# EasyEDA Pro project 3轴6.1--esp32 -(0105).eprj, schematic 原理图
Board Name: esp32; Create Date: 2025-05-14; Page Name: 电源; Project Name: 3轴6.1--esp32 -(0105); Schematic Name: 原理图; Update Date: 2026-01-12; Company: 嘉立创EDA; Page Size: A3; Version: V1.0
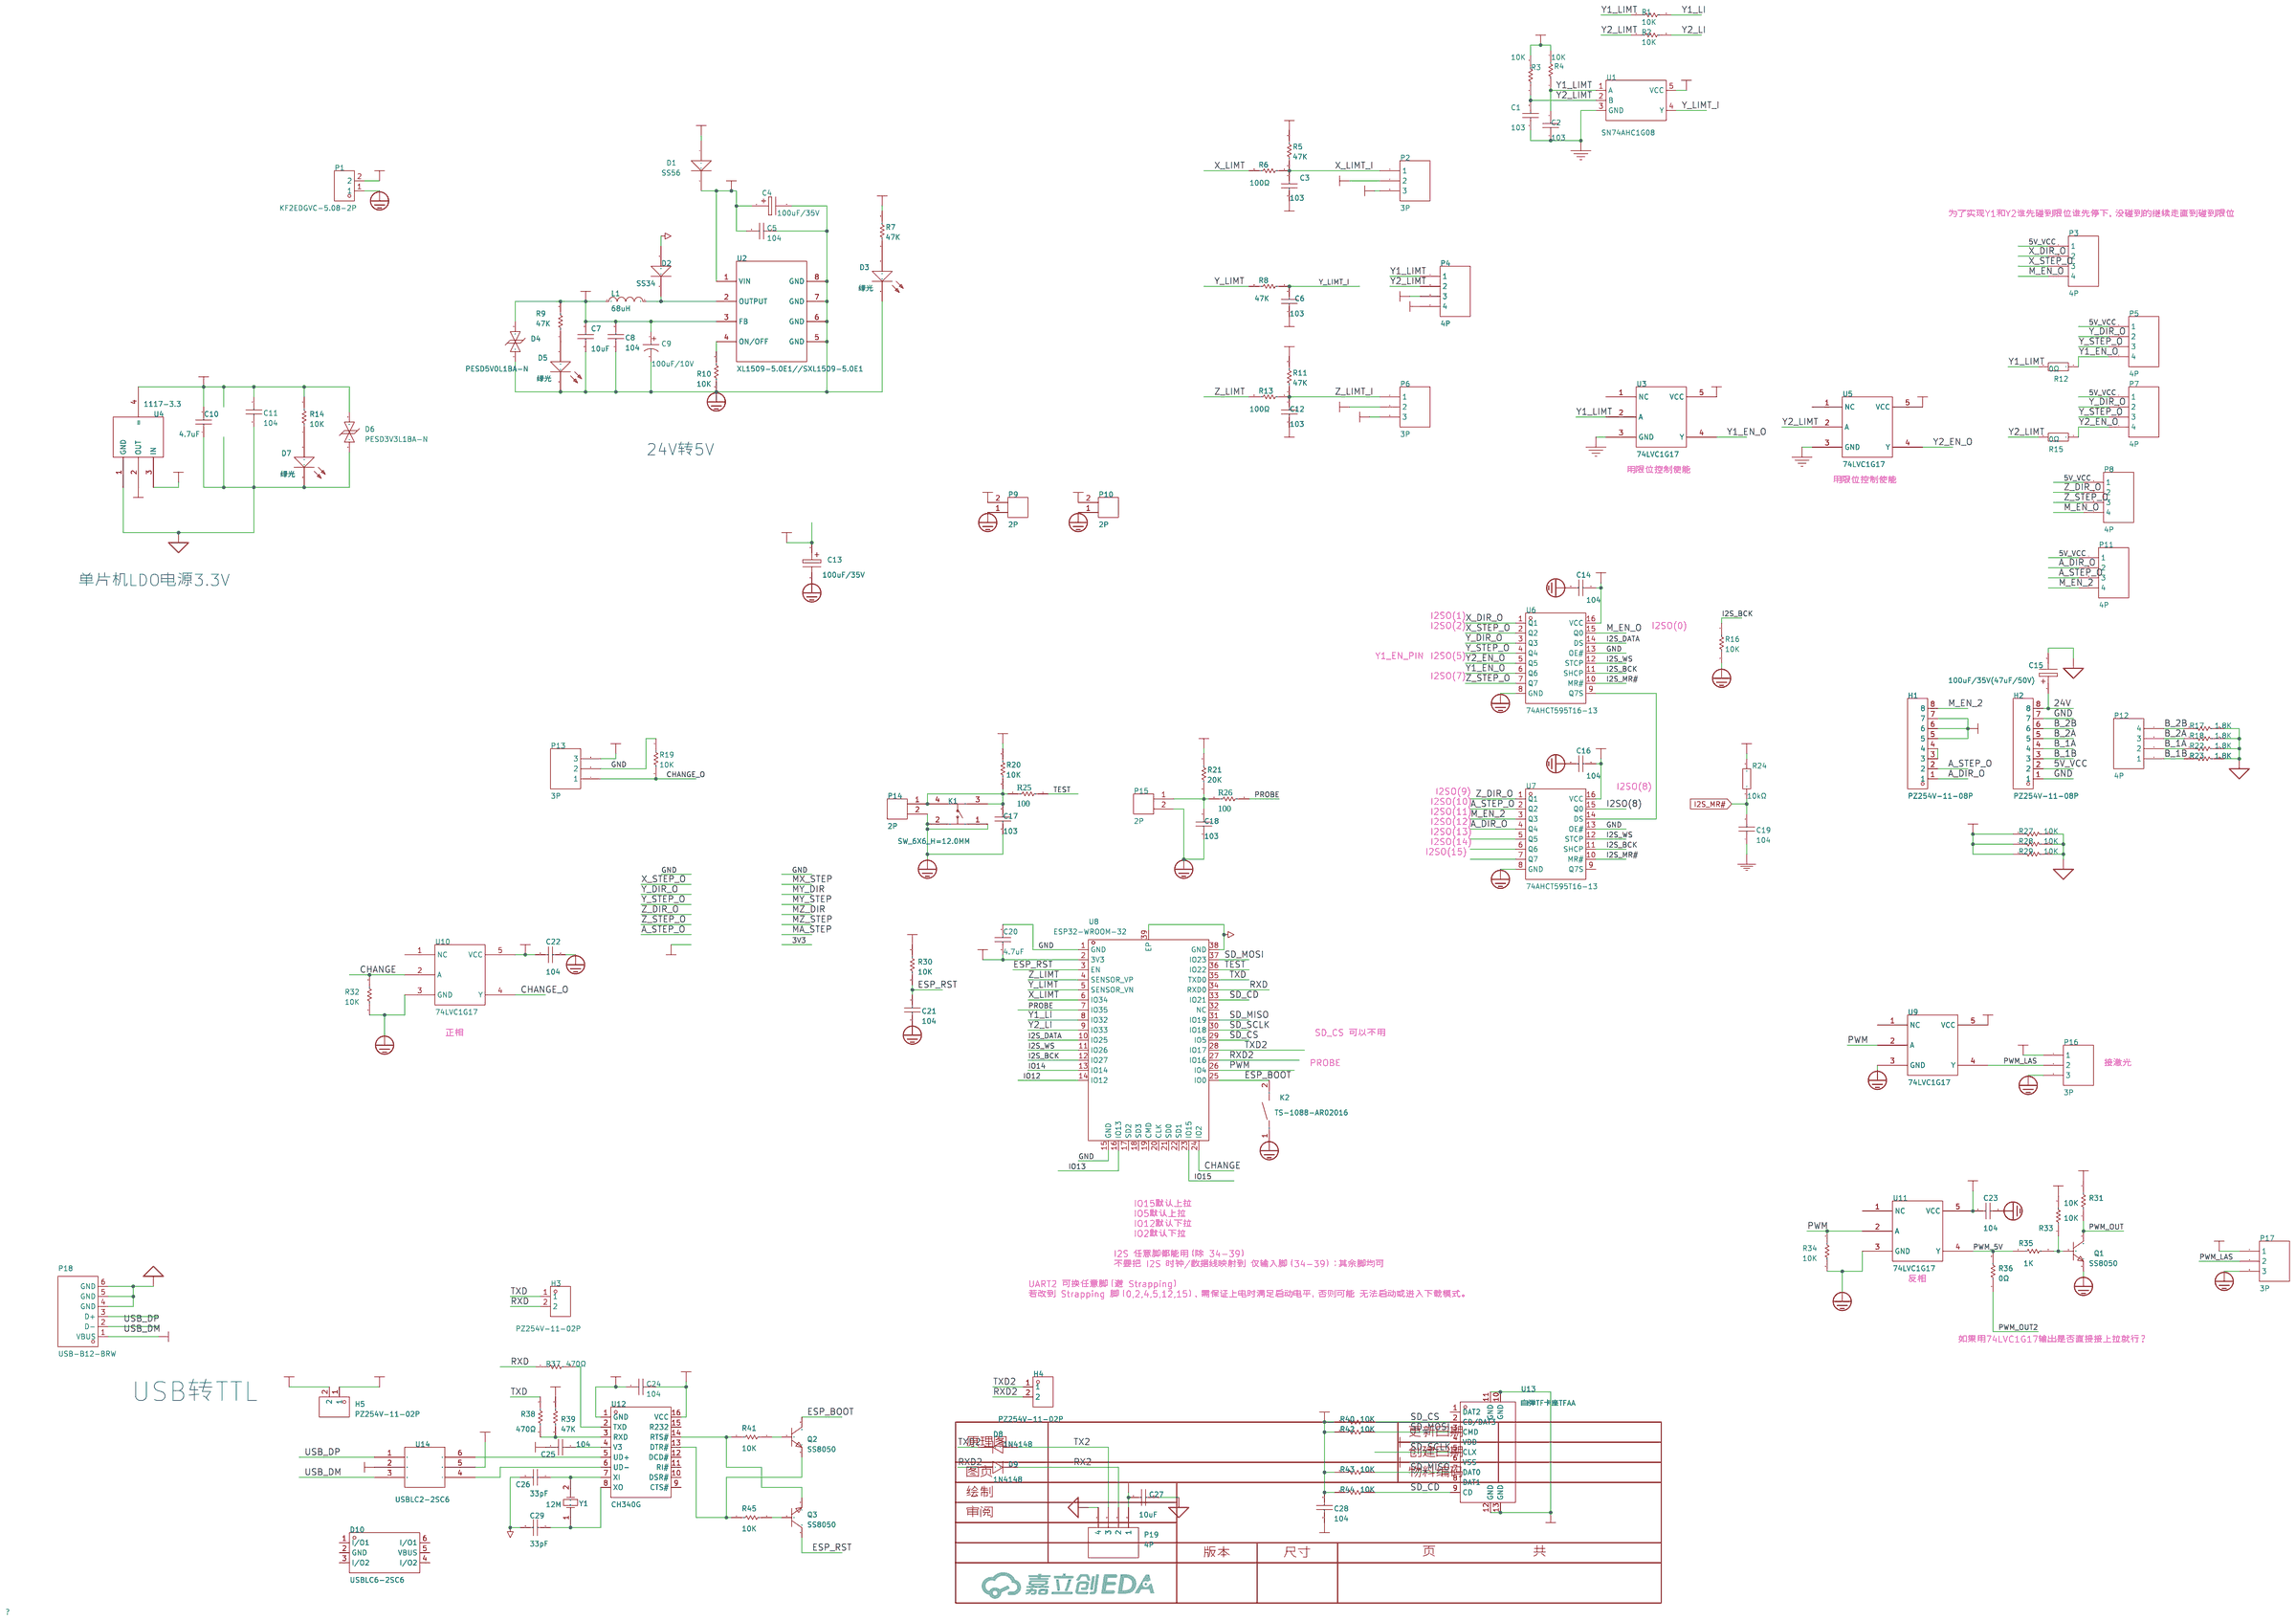
[diagram p0: schematic sheet]

## Parts
C1  103  [11]
C2  103  [11]
C3  103  [11]
C4  100uF/35V  [电解电容贴片6X6]
C5  104  [0603C]
C6  103  [11]
C7  10uF  [C1206]
C8  104  [0603C]
C9  100uF/10V  [CAP-SMD_BD5.0-L5.3-W5.3-RD]
C10  4.7uF  [C1206]
C11  104  [0603C]
C12  103  [11]
C13  100uF/35V  [电解电容贴片6X6]
C14  104  [0603C]
C15  100uF/35V(47uF/50V)  [电解电容贴片6X6]
C16  104  [0603C]
C17  103  [11]
C18  103  [11]
C19  104  [0603C]
C20  4.7uF  [C1206]
C21  104  [0603C]
C22  104  [0603C]
C23  104  [0603C]
C24  104  [0603C]
C25  104  [0603C]
C26  18pF  [0603C]
C27  10uF  [C1206]
C28  104  [11]
C29  18pF  [0603C]
D1  SS56  [SMA]
D2  SS34  [SMA]
D3  绿光  [0603LED]
D4  PESD5V0L1BA-N  [SOD-323_L1.8-W1.3-LS2.5-BI]
D5  绿光  [0603LED]
D6  PESD3V3L1BA-N  [SOD-323_L1.8-W1.3-LS2.5-BI]
D7  绿光  [0603LED]
D8  1N4148  [SOD-123_L2.8-W1.8-LS3.7-RD]
D9  1N4148  [SOD-123_L2.8-W1.8-LS3.7-RD]
D10  USBLC6-2SC6  [SOT-23-6_L2.9-W1.6-P0.95-LS2.8-BL]
H1  PZ254V-11-08P  [HDR-TH_8P-P2.54-V-M]
H2  PZ254V-11-08P  [HDR-TH_8P-P2.54-V-M]
H3  PZ254V-11-02P  [HDR-TH_2P-P2.54-V-M]
H4  PZ254V-11-02P  [HDR-TH_2P-P2.54-V-M]
H5  PZ254V-11-02P  [HDR-TH_2P-P2.54-V-M]
K1  SW_6X6_H=12.0MM  [KEY-SMD_4P-L6.0-W6.0-P4.50-LS9.0]
K2  TS-1088-AR02016  [SW-SMD_L3.9-W3.0-P4.45]
L1  68uH  [IND-SMD_L7.0-W7.0_SMDRI74-330MT]
P1  KF2EDGVC-5.08-2P  [CONN-TH_P5.08_KF2EDGVC-5.08-2P]
P2  3P  [HDR1X3_CON]
P3  4P  [HDR1X4_CON]
P4  4P  [HDR1X4_CON]
P5  4P  [HDR1X4_CON]
P6  3P  [HDR1X3_CON]
P7  4P  [HDR1X4_CON]
P8  4P  [HDR1X4_CON]
P9  2P  [HDR1X2_CON]
P10  2P  [HDR1X2_CON]
P11  4P  [HDR1X4_CON]
P12  4P  [HDR1X4_CON]
P13  3P  [HDR1X3_CON]
P14  2P  [HDR1X2_CON]
P15  2P  [HDR1X2_CON]
P16  3P  [HDR1X3_CON]
P17  3P  [HDR1X3_CON]
P18  USB-B12-BRW  [USB-B-TH_USB-B12-BRW]
P19  4P  [HDR1X4_CON]
Q1  SS8050  [SOT-23-3_L2.9-W1.3-P1.90-LS2.4-BR]
Q2  SS8050  [SOT-23-3_L2.9-W1.3-P1.90-LS2.4-BR]
Q3  SS8050  [SOT-23-3_L2.9-W1.3-P1.90-LS2.4-BR]
R1  10K  [0603R]
R2  10K  [0603R]
R3  10K  [0603R]
R4  10K  [0603R]
R5  47K  [10]
R6  100Ω  [10]
R7  47K  [0603R]
R8  47K  [10]
R9  10K  [0603R]
R10  10K  [0603R]
R11  47K  [10]
R12  0Ω  [R0603]
R13  100Ω  [10]
R14  10K  [0603R]
R15  0Ω  [R0603]
R16  10K  [0603R]
R17  10K  [0603R]
R18  10K  [0603R]
R19  10K  [0603R]
R20  10K  [0603R]
R21  10K  [0603R]
R22  10K  [0603R]
R23  10K  [0603R]
R24  10kΩ  [R0603]
R25  100  [0603R]
R26  100  [0603R]
R27  10K  [0603R]
R28  10K  [0603R]
R29  10K  [0603R]
R30  10K  [0603R]
R31  10K  [0603R]
R32  10K  [0603R]
R33  10K  [0603R]
R34  10K  [0603R]
R35  1K  [0603R]
R36  0Ω  [0603R]
R37  470Ω  [0603R]
R38  470Ω  [0603R]
R39  10K  [0603R]
R40  10K  [10]
R41  10K  [0603R]
R42  10K  [10]
R43  10K  [10]
R44  10K  [10]
R45  10K  [0603R]
U1  SN74AHC1G08  [SC-70-5_L2.1-W1.3-P0.65-LS2.1-BR]
U2  XL1509-5.0E1//SXL1509-5.0E1  [ESOP-8_L4.9-W3.9-P1.27-LS6.0-BL-EP]
U3  74LVC1G17  [SOT-23-5]
U4  1117-3.3  [SOT-223]
U5  74LVC1G17  [SOT-23-5]
U6  74AHCT595T16-13  [TSSOP-16_L5.0-W4.4-P0.65-LS6.4-BL]
U7  74AHCT595T16-13  [TSSOP-16_L5.0-W4.4-P0.65-LS6.4-BL]
U8  ESP32-WROOM-32  [WIFI-SMD_ESP32-WROOM-32UE-A]
U9  74LVC1G17  [SOT-23-5]
U10  74LVC1G17  [SOT-23-5]
U11  74LVC1G17  [SOT-23-5]
U12  CH340G  [SOIC-16_L9.9-W3.9-P1.27-LS6.0-BL]
U13  自弹TF卡座TFAA  [SIM-SMD_C9900015645]
U14  USBLC2-2SC6  [SOT-23-6]
Y1  12M  [晶振贴片49SSMD]

## Library data of the parts
C1-C3 C6 C12 C17 C18 = 103: Design Item ID: CAP; Library Name: SCH封装库
C4 C13 C15 = 100uF/35V: Origin Footprint 2: X47U; Origin Footprint 1: 电解电容贴片6x6; Design Item ID: ELECTRO1; Library Name: *
C5 C8 C11 C14 C16 C19 C21-C23 = 104: Capacitor (Semiconductor SIM Model); Published: 8-Jun-2000; LatestRevisionDate: 17-Jul-2002; LatestRevisionNote: Re-released for DXP Platform.; PackageReference: C1206; Publisher: Altium Limited; Origin Footprint 2: C1206; Origin Footprint 3: 0402; Origin Footprint 4: 1310[0504]; Origin Footprint 5: 1608[0603]; Origin Footprint 6: C1210; Origin Footprint 7: C0805; Origin Footprint 8: C1206; Origin Footprint 9: 0805; Origin Footprint 10: 0805L; Design Item ID: Cap Semi; Library Name: Miscellaneous Devices
C7 C10 C20 C27 = 104: Design Item ID: CAP; Library Name: SCH--װ--
C9 = CS1A101M-CRD54: 容值:100uF;精度:±20%;额定电压:10V;电容体直径:5mm;电容体长度:5.4mm;纹波电流:-;等效串联电阻:-;工作寿命:1000hrs@105℃;工作温度:-40℃~+105℃;; LCSC Part Name: 100uF ±20% 10V; Supplier Part: C96182; Manufacturer: ST(先科); Supplier Footprint: SMD,5x5.4mm; JLCPCB Part Class: Extended Part; Datasheet: https://atta.szlcsc.com/upload/public/pdf/source/20170304/1488621207726.pdf; Supplier: LCSC; Tolerance: ±20%; Rated Voltage: 10V; φD: 5mm; L: 5.4mm; Lifetime @ Temp: 1000hrs@105℃; Operating Temperature: -40℃~+105℃
C24 = 103: Capacitor (Semiconductor SIM Model); Published: 8-Jun-2000; LatestRevisionDate: 17-Jul-2002; LatestRevisionNote: Re-released for DXP Platform.; PackageReference: C1206; Publisher: Altium Limited; Origin Footprint 2: C1206; Origin Footprint 3: 0402; Origin Footprint 4: 1310[0504]; Origin Footprint 5: 1608[0603]; Origin Footprint 6: C1210; Origin Footprint 7: C0805; Origin Footprint 8: C1206; Origin Footprint 9: 0805; Origin Footprint 10: 0805L; Design Item ID: Cap Semi; Library Name: Miscellaneous Devices
C25 = 104: Capacitor (Semiconductor SIM Model); Published: 8-Jun-2000; LatestRevisionDate: 17-Jul-2002; LatestRevisionNote: Re-released for DXP Platform.; PackageReference: C1206; Publisher: Altium Limited; Origin Footprint 2: C1206; Origin Footprint 3: 0402; Origin Footprint 4: 1310[0504]; Origin Footprint 5: 1608[0603]; Origin Footprint 6: C1210; Origin Footprint 7: C0805; Origin Footprint 8: C1206; Origin Footprint 9: 0805; Origin Footprint 10: 0805L; Origin Footprint 11: 0805C; Design Item ID: Cap Semi; Library Name: Miscellaneous Devices
C26 C29 = 33pF: Capacitor (Semiconductor SIM Model); Published: 8-Jun-2000; LatestRevisionDate: 17-Jul-2002; LatestRevisionNote: Re-released for DXP Platform.; PackageReference: C1206; Publisher: Altium Limited; Origin Footprint 2: C1206; Origin Footprint 3: 0402; Origin Footprint 4: 1310[0504]; Origin Footprint 5: 1608[0603]; Origin Footprint 6: C1210; Origin Footprint 7: C0805; Origin Footprint 8: C1206; Origin Footprint 9: 0805; Origin Footprint 10: 0805L; Design Item ID: Cap Semi; Library Name: Miscellaneous Devices
C28 = 104: Capacitor (Semiconductor SIM Model); Published: 8-Jun-2000; LatestRevisionDate: 17-Jul-2002; LatestRevisionNote: Re-released for DXP Platform.; PackageReference: C1206; Publisher: Altium Limited; Origin Footprint 2: C1206; Origin Footprint 3: 0402; Origin Footprint 4: 1310[0504]; Origin Footprint 5: 1608[0603]; Origin Footprint 6: C1210; Origin Footprint 7: C0805; Origin Footprint 8: C1206; Origin Footprint 9: 0805; Origin Footprint 10: 0805L; Origin Footprint 11: 0805C; Origin Footprint 1: 0603C; Design Item ID: Cap Semi; Library Name: Miscellaneous Devices
D1 = SS56: Design Item ID: 1N4148; Library Name: SCH封装库
D2 = SS56: Design Item ID: 1N4148; Library Name: SCH--װ--
D3 D5 D7 = 绿光: Origin Footprint 2: LED(小); Design Item ID: LED; Library Name: SCH封装库
D4 D6 = PESD5V0S1BBN: 极性:Bidirectional;反向关断电压（典型值）:5V (Max);击穿电压（最小值）:6V;箝位电压:15V;峰值脉冲电流（10/1000us）:5A (8/20us);; Supplier Part: C314264; Manufacturer: BORN伯恩半导体; Supplier Footprint: SOD-523; JLCPCB Part Class: Extended Part; Datasheet: https://atta.szlcsc.com/upload/public/pdf/source/20181015/C314264_F9AC5761AC2631DA841FBD1D9C6821E3.pdf; Supplier: LCSC; Polarity: Bidirectional; Voltage - Reverse Standoff (Typ): 5V (Max); Voltage - Breakdown (Min): 6V; Voltage - Clamping (Max) @ Ipp: 15V; Current - Peak Pulse (10/1000μs): 5A (8/20us)
D8 D9 = 1N4148W-TP: LCSC Part Name: 100V 150mA 4ns; Supplier Part: C77978; Manufacturer: MCC(美微科); Supplier Footprint: SOD-123; JLCPCB Part Class: Extended Part; Datasheet: https://atta.szlcsc.com/upload/public/pdf/source/20161112/1478931639357.pdf; Supplier: LCSC; Power Dissipation: 400mW; Reverse Voltage (Vr): 100V; Average Rectified Current (Io): 150mA; Forward Voltage (Vf@If): 1.25V@150mA; Reverse Leakage Current: 1μA@75V; Reverse Recovery Time (trr): 4ns; Operating Temperature: -65℃~+150℃@(Tj)
D10 = USBLC6-2SC6: 最大钳位电压:15V;击穿电压:6V;; Supplier Part: C2687116; Manufacturer: UMW(友台半导体); Supplier Footprint: SOT-23-6; JLCPCB Part Class: 扩展库; Datasheet: https://atta.szlcsc.com/upload/public/pdf/source/20231109/512642D850D9873E7C519F71E85B9A10.pdf; Supplier: LCSC; Maximum Clamping Voltage: 15V; Breakdown Voltage: 6V; Number of Lines: 双路; Type: ESD
H1 H2 = PZ254V-11-08P: LCSC Part Name: 间距:2.54mm 1x8P 直插 方针; Supplier Part: C492407; Manufacturer: XFCN(兴飞); Supplier Footprint: 插件,P=2.54mm; JLCPCB Part Class: 扩展库; Datasheet: https://atta.szlcsc.com/upload/public/pdf/source/20200309/C492407_83A6FB26A2233368EDB9516968EC6149.pdf; Supplier: LCSC; Pin Structure: 1x8P; Pitch: 2.54mm; Circluar Pins/Square Pins: 方针; Mounting Type: 直插; Number of Rows: 单排; Number of Pins: 8P; Length of Mating Pin: 6mm; Insulation Height: 2.5mm; Length of End Connection Pin: 3mm; Contact Material: 黄铜; Operating Temperature Range: -40℃~+105℃; Color: 黑色
H3-H5 = PZ254V-11-02P: 插针结构:1x2P;间距:2.54mm;行距:-;圆针/方针:方针;安装类型:直插;排数:单排;总PIN位数:2P;额定电流:-;额定电压:-;配合针长度:6mm;塑高:2.5mm;端接针长度:3mm;触头材质:黄铜;触头镀层:-;工作温度范围:-40℃~+105℃;颜色:黑色;; LCSC Part Name: 间距:2.54mm 1x2P 直插 方针; Supplier Part: C492401; Manufacturer: XFCN(兴飞); Supplier Footprint: 插件,P=2.54mm; JLCPCB Part Class: 扩展库; Datasheet: https://atta.szlcsc.com/upload/public/pdf/source/20200309/C492401_A812433581A9B211A7FFA413ADDFF0E5.pdf; Supplier: LCSC; Pin Structure: 1x2P; Pitch: 2.54mm; Circluar Pins/Square Pins: 方针; Mounting Type: 直插; Number of Rows: 单排; Number of Pins: 2P; Length of Mating Pin: 6mm; Insulation Height: 2.5mm; Length of End Connection Pin: 3mm; Contact Material: 黄铜; Operating Temperature Range: -40℃~+105℃; Color: 黑色
K1 = SW_6X6_H=12.0MM: Supplier Part: C9900018802; Supplier Footprint: KEY-SMD; JLCPCB Part Class: 扩展库; Supplier: LCSC
K2 = TS-1088-AR02016: LCSC Part Name: 4*3*2mm 立贴 轻触开关; Supplier Part: C720477; Manufacturer: XUNPU(讯普); Supplier Footprint: SMD; JLCPCB Part Class: 基础库; Datasheet: https://atta.szlcsc.com/upload/public/pdf/source/20200810/C720475_60D09DD6C54279ADDB2DC25100F1CC11.pdf; Supplier: LCSC; Circuit: 单刀单掷; Actuator Style: 圆形按钮; Operating Force: 160gf; Mounting Style: 立贴; Switch Length: 4mm; Switch Width: 3mm; Switch Height: 2mm; Strike Gundam: 不带; Contact Current: 50mA; Voltage Rating (DC): 12V; Insulation Resistance: 100MΩ; Actuator/Cap Color: 黑色; Pin Style: SMD接片; Mechanical Life: 10万次; Operating Temperature: -30℃~+80℃
L1 = SMDRI74-330MT: 电感值:33uH;精度:±20%;额定电流:960mA;饱和电流(Isat):1.8A;类型:屏蔽电感;; LCSC Part Name: 33uH±20%1.8A; Supplier Part: C49625; Manufacturer: SXN(顺翔诺); Supplier Footprint: SMD,7.5x7.5mm; JLCPCB Part Class: 扩展库; Datasheet: https://atta.szlcsc.com/upload/public/pdf/source/20210810/6F96FDC19AA308DD2AD166FFB9640E87.pdf; Supplier: LCSC; Tolerance: ±20%; Rated Current: 960mA; Saturation Current (Isat): 1.8A; DC Resistance (DCR): 170mΩ; Type: 屏蔽电感
P1 = KF2EDGVC-5.08-2P: 连接器类型:板端/插座-闭口;结构:1x2P;间距:5.08mm;颜色:绿色;安装方式:直针;排数:1;每排PIN数:2;额定电流:15A;额定电压:300V;工作温度:-40℃~+105℃;; LCSC Part Name: 5.08mm 1x2P 排数:1 每排P数:2; Supplier Part: C441386; Manufacturer: KEFA(科发); Supplier Footprint: 插件,P=5.08mm; JLCPCB Part Class: 扩展库; Datasheet: https://item.szlcsc.com/datasheet/KF2EDGVC-5.08-2P/441359.html; Supplier: LCSC; Connector Type: 板端/插座-闭口; Number of Positions or Pins: 1x2P; Pitch: 5.08mm; Color: 绿色; Mounting Type: 直针; Number of Pins: 2P; Number of Rows: 1; Number of PINs Per Row: 2; Current Rating: 15A; Voltage Rating (Max): 300V; Operating Temperature: -40℃~+105℃
P2 P6 P13 P16 P17 = 3P: Library Name: SCH封装库
P3-P5 P7 P8 P11 P12 P19 = 4P: Library Name: SCH封装库
P9 P10 P14 P15 = 2P: Library Name: SCH--װ--
P18 = USB-B12-BRW: 连接器类型:Type-B;协议标准:USB 2.0;公母:母;安装方式:直插;触点数量:4P;端口数量:1;额定电流 - 电源:1.5A;工作温度:-20℃~+70℃;; LCSC Part Name: Type-B 母 直插; Supplier Part: C720550; Manufacturer: XUNPU(讯普); Supplier Footprint: 插件; JLCPCB Part Class: 扩展库; Datasheet: https://item.szlcsc.com/datasheet/USB-B12-BRW/763557.html; Supplier: LCSC; Connector Type: Type-B; Protocol Standard: USB 2.0; Gender: 母; Mounting Type: 直插; Number of Contacts: 4P; Number of Ports: 1; Current Rating-Power: 1.5A; Voltage Rating: 30V; Connect-Disconnect Life: 5千次; Length: 16.1mm; Detection color: 白色; Operating Temperature: -20℃~+70℃
Q1 = SS8050: 晶体管类型:NPN;集射极击穿电压(Vceo):25V;集电极电流(Ic):1.5A;功率(Pd):300mW;集电极-发射极饱和电压(VCE(sat)@Ic,Ib):500mV@800mA,80mA;直流电流增益(hFE@Ic,Vce):200@100mA,1V;特征频率(fT):100MHz;工作温度:+150℃@(Tj);; LCSC Part Name: SS8050 Y1 200-350 Y1 200-350; Supplier Part: C2150; Manufacturer: CJ（江苏长电/长晶）; Supplier Footprint: SOT-23(SOT-23-3); JLCPCB Part Class: Basic Part; Datasheet: https://atta.szlcsc.com/upload/public/pdf/source/20140809/1457707209319.pdf; Supplier: LCSC; Transistor Type: NPN; Collector-Emitter Breakdown Voltage (Vceo): 25V; Collector Current (Ic): 1.5A; Power Dissipation (Pd): 300mW; Collector-Emitter Saturation Voltage (VCE(sat)@Ic,Ib): 500mV@800mA,80mA; DC Current Gain (hFE@Ic,Vce): 200@100mA,1V; Transition Frequency (fT): 100MHz; Operating Temperature: +150℃@(Tj)
Q2 Q3 = SS8050: LCSC Part Name: NPN 25V 1.5A 120-400 SOT-23; Supplier Part: C2931717; Manufacturer: Doeshare(德芯); Supplier Footprint: SOT-23; JLCPCB Part Class: 扩展库; Datasheet: https://atta.szlcsc.com/upload/public/pdf/source/20220106/99F9A3DFCBDD91265C711555CE6390BF.pdf; Supplier: LCSC
R1-R4 R9 R14 R16 R19-R21 R30 R39 R41 R45 = 10K: Resistor; Published: 8-Jun-2000; LatestRevisionDate: 17-Jul-2002; LatestRevisionNote: Re-released for DXP Platform.; PackageReference: AXIAL-0.3; Publisher: Altium Limited; Origin Footprint 2: AXIAL-0.3; Origin Footprint 3: R0805; Origin Footprint 4: 0805R; Design Item ID: RES; Library Name: SCH封装库
R5 R11 R40 R42-R44 = 10K: Resistor; Published: 8-Jun-2000; LatestRevisionDate: 17-Jul-2002; LatestRevisionNote: Re-released for DXP Platform.; PackageReference: AXIAL-0.3; Publisher: Altium Limited; Origin Footprint 2: AXIAL-0.3; Origin Footprint 3: R0805; Origin Footprint 4: 0805R; Origin Footprint 1: 0603R; Design Item ID: RES; Library Name: SCH封装库
R6 R8 R13 = 100: Resistor; Published: 8-Jun-2000; LatestRevisionDate: 17-Jul-2002; LatestRevisionNote: Re-released for DXP Platform.; PackageReference: AXIAL-0.3; Publisher: Altium Limited; Origin Footprint 2: AXIAL-0.3; Origin Footprint 3: R0805; Origin Footprint 4: 0805R; Origin Footprint 1: 0603R; Design Item ID: RES; Library Name: SCH封装库
R7 = 1K: Resistor; Published: 8-Jun-2000; LatestRevisionDate: 17-Jul-2002; LatestRevisionNote: Re-released for DXP Platform.; PackageReference: AXIAL-0.3; Publisher: Altium Limited; Origin Footprint 2: AXIAL-0.3; Origin Footprint 3: R0805; Origin Footprint 4: 0805R; Design Item ID: RES; Library Name: SCH封装库
R10 = 10k: Resistor; Published: 8-Jun-2000; LatestRevisionDate: 17-Jul-2002; LatestRevisionNote: Re-released for DXP Platform.; PackageReference: AXIAL-0.3; Publisher: Altium Limited; Origin Footprint 2: AXIAL-0.3; Origin Footprint 3: R0805; Origin Footprint 4: 0805R; Design Item ID: RES; Library Name: SCH封装库
R12 R15 = RT0603BRD0710KL: 电阻类型:薄膜电阻;阻值:10kΩ;精度:±0.1%;功率:100mW;温度系数:±25ppm/;最大工作电压:75V;工作温度范围:-55~+155;; LCSC Part Name: 10k-- --0.1%; Supplier Part: C95204; Manufacturer: YAGEO(----); Supplier Footprint: 0603; JLCPCB Part Class: Extended Part; Datasheet: https://atta.szlcsc.com/upload/public/pdf/source/20170217/1487301593756.pdf; Supplier: LCSC; Type: --Ĥ----; Tolerance: --0.1%; Power(Watts): 100mW; Temperature Coefficient: --25ppm/; Overload Voltage (Max): 75V; Operating Temperature Range: -55~+155; Origin Footprint 2: 0402R; Origin Footprint 3: 0402R; Origin Footprint 4: 0603; Check: true
R17 R18 R22 R23 R27-R29 R31-R34 = 10K: Resistor; Published: 8-Jun-2000; LatestRevisionDate: 17-Jul-2002; LatestRevisionNote: Re-released for DXP Platform.; PackageReference: AXIAL-0.3; Publisher: Altium Limited; Origin Footprint 2: AXIAL-0.3; Origin Footprint 3: R0805; Origin Footprint 4: 0805R; Design Item ID: RES; Library Name: SCH--װ--
R24 = 10kΩ: Supplier: LCSC; Manufacturer: UniOhm; Manufacturer Part: 0603WAF1002T5E; Supplier Part: C25804; Resistance: 10K; JLCPCB Part Class: Basic Part
R25 R26 R35-R38 = 100: Resistor; Published: 8-Jun-2000; LatestRevisionDate: 17-Jul-2002; LatestRevisionNote: Re-released for DXP Platform.; PackageReference: AXIAL-0.3; Publisher: Altium Limited; Origin Footprint 2: AXIAL-0.3; Origin Footprint 3: R0805; Origin Footprint 4: 0805R; Design Item ID: RES; Library Name: SCH--װ--
U1 = SN74AHC1G08DCKR: Supplier Part: C122838; Manufacturer: TI(德州仪器); Supplier Footprint: SC-70-5; JLCPCB Part Class: 扩展库; Datasheet: https://www.ti.com/cn/lit/gpn/sn74ahc1g08; Supplier: LCSC; Logic Type: 与门; Number of Channels: 1; Voltage - Supply: 2V~5.5V; Quiescent Current: 1uA; Current - Output Low(IOL): 8mA; Current - Output High(IOH): 8mA; Input Logic Level - High: 1.5V~3.85V; Input Logic Level - Low: 500mV~1.65V; Series: 74AHC系列; Propagation Delay: 7.9ns@5V,50pF; Operating Temperature: -55℃~+125℃
U2 = XL1509-5.0E1: 功能类型:降压型;同步整流:-;输出通道数:-;拓扑结构:-;输入电压:-;输出电流(最大值):-;开关频率:-;; LCSC Part Name: 降压型; Supplier Part: C61063; Manufacturer: XLSEMI(芯龙); Supplier Footprint: SOP-8_150mil; JLCPCB Part Class: Basic Part; Datasheet: https://atta.szlcsc.com/upload/public/pdf/source/20151020/1457707483545.pdf; Supplier: LCSC; Function: 降压型
U3 U5 U9-U11 = 74LVC1G04: Library Name: SCH--װ--
U4 = 1117-3.3: Design Item ID: LM1117; Library Name: Party600
U6 U7 = 74AHCT595T16-13: 功能:串行至串行或并行;工作电压:4.5V~5.5V;元件数:1;每个元件位数:8;; Supplier Part: C460504; Manufacturer: DIODES(美台); Supplier Footprint: TSSOP-16; JLCPCB Part Class: 扩展库; Datasheet: https://atta.szlcsc.com/upload/public/pdf/source/20181012/C126402_1C2CD61366A0E74343C8903136947225.pdf; Supplier: LCSC; Function: 串行至串行或并行; Voltage - Supply: 4.5V~5.5V; Number of Elements: 1; Number of Bits per Element: 8; Output Type: 三态; Series: 74AHCT; Operating Temperature: -40℃~+125℃
U8 = ESP32-WROOM-32: Supplier Part: C95209; Manufacturer: ESPRESSIF(乐鑫); JLCPCB Part Class: 扩展库; Datasheet: https://atta.szlcsc.com/upload/public/pdf/source/20170925/C95209_1506321763821990573.pdf; Supplier: LCSC
U12 = CH340G: 应用功能:收发器;接口协议:USB 2.0;数据速率:2Mbps;; LCSC Part Name: USB转串口芯片 CH340; Supplier Part: C14267; Manufacturer: WCH(南京沁恒); Supplier Footprint: SOP-16; JLCPCB Part Class: 扩展库; Datasheet: https://atta.szlcsc.com/upload/public/pdf/source/20230530/6E401E9554E9F5311886CC8B3F89B62E.pdf; Supplier: LCSC; Applications Function: 收发器; Protocol: USB 2.0; Supply Voltage: 3.3V；5V; Data Rate: 2Mbps
U13 = 自弹TF卡座TFAA: Supplier Part: C9900015645; Supplier Footprint: SMD; JLCPCB Part Class: 扩展库; Supplier: LCSC
U14 = USBLC2-2SC6: Design Item ID: DIP6; Library Name: SCH封装库
Y1 = 12M: Crystal Oscillator; Published: 8-Jun-2000; LatestRevisionDate: 17-Jul-2002; LatestRevisionNote: Re-released for DXP Platform.; PackageReference: R38; Publisher: Altium Limited; Origin Footprint 2: R38; Origin Footprint 3: XTAL-49S; Design Item ID: XTAL; Library Name: Miscellaneous Devices

## Nets
3V3: C10.2 C11.2 C20.1 C28.2 D6.2 R14.2 R20.1 R30.1 R40.2 R42.2 R43.2 R44.2 U4.2(OUT) U4.4(=) U8.2(3V3) U13.4(VDD)
5V_VCC: C7.1 C8.2 C9.1 C14.1 C16.1 C22.2 C23.2 C24.1 C27.1 D4.2 H1.5 H1.6 H1.7 H2.2 H5.1 L1.1 P2.3 P3.1 P4.4 P5.1 P6.3 P7.1 P8.1 P11.1 P13.3 P17.1 P19.1 R3.1 R4.1 R5.2 R9.2 R11.2 R21.1 R24.2 R27.1 R28.1 R29.1 R31.2 R33.2 R39.2 U1.5(VCC) U2.3(FB) U3.5(VCC) U4.3(IN) U5.5(VCC) U6.16(VCC) U7.16(VCC) U9.5(VCC) U10.5(VCC) U11.5(VCC) U12.16(VCC)
24V: C13.1 C15.1 D1.1 H2.8 P1.2 P9.2 P10.2 P16.1 R7.2
GND: C1.1 C2.1 C3.1 C4.2 C5.1 C6.1 C7.2 C8.1 C9.2 C10.1 C11.1 C12.1 C13.2 C14.2 C15.2 C16.2 C17.1 C18.1 C19.1 C20.2 C21.1 C22.1 C23.1 C24.2 C25.2 C26.2 C27.2 C28.1 C29.2 D2.1 D3.2 D4.1 D5.2 D6.1 D7.2 H2.1 H2.7 K1.1 K1.2 K2.1 P1.1 P2.2 P4.3 P6.2 P9.1 P10.1 P13.2 P14.2 P15.2 P16.3 P17.3 P18.4(GND) P18.5(GND) P18.6(GND) P19.4 Q1.2(E) R10.2 R16.2 R17.2 R18.2 R19.1 R22.2 R23.2 R27.2 R28.2 R29.2 R32.2 R34.2 U1.3(GND) U2.5(GND) U2.6(GND) U2.7(GND) U2.8(GND) U3.3(GND) U4.1(GND) U5.3(GND) U6.8(GND) U6.13(OE#) U7.8(GND) U7.13(OE#) U8.1(GND) U8.15(GND) U8.38(GND) U8.39(EP) U9.3(GND) U10.3(GND) U11.3(GND) U12.1(GND) U13.6(VSS) U13.10(GND) U13.11(GND) U13.12(GND) U13.13(GND) U14.2
VIN_24V: C4.1 C5.2 D1.2 U2.1(VIN)
A_DIR_O: H1.1 P11.2 U7.4(Q4)
A_STEP_O: H1.2 P11.3 U7.2(Q2)
B_1A: H2.4 P12.2 R22.1
B_1B: H2.3 P12.1 R23.1
B_2A: H2.5 P12.3 R18.1
B_2B: H2.6 P12.4 R17.1
CHANGE: R32.1 U8.24(IO2) U10.2(A)
CHANGE_O: P13.1 R19.2 U10.4(Y)
ESP_BOOT: K2.2 Q2.3(C) U8.25(IO0)
ESP_RST: C21.2 Q3.3(C) R30.2 U8.3(EN)
I2S_BCK: R16.1 U6.11(SHCP) U7.11(SHCP) U8.12(IO27)
I2S_DATA: U6.14(DS) U8.10(IO25)
I2S_MR#: C19.2 R24.1 U6.10(MR#) U7.10(MR#)
I2S_WS: U6.12(STCP) U7.12(STCP) U8.11(IO26)
I2SO(8): U7.15(Q0)
IO12: U8.14(IO12)
IO13: U8.16(IO13)
IO14: U8.13(IO14)
IO15: U8.23(IO15)
M_EN_2: H1.8 P11.4 U7.3(Q3)
M_EN_O: P3.4 P8.4 U6.15(Q0)
PROBE: R26.1 U8.7(IO35)
PWM: R34.1 U8.26(IO4) U9.2(A) U11.2(A)
PWM_5V: R35.1 R36.2 U11.4(Y)
PWM_LAS: P16.2 P17.2 U9.4(Y)
PWM_OUT: Q1.3(C) R31.1
PWM_OUT2: R36.1
RX2: D9.1(c) P19.2
RXD: H3.2 R37.1 U8.34(RXD0)
RXD2: D9.2(A) H4.2 U8.27(IO16)
SD_CD: R44.1 U8.33(IO21) U13.9(CD)
SD_CS: R40.1 U8.29(IO5) U13.2(CD/DAT3)
SD_MISO: R43.1 U8.31(IO19) U13.7(DAT0)
SD_MOSI: R42.1 U8.37(IO23) U13.3(CMD)
SD_SCLK: U8.30(IO18) U13.5(CLX)
TEST: R25.1 U8.36(IO22)
TX2: D8.2(A) P19.3
TXD: H3.1 R38.1 U8.35(TXD0)
TXD2: D8.1(c) H4.1 U8.28(IO17)
USB_DM: P18.2(D-) U14.3
USB_DP: P18.3(D+) U14.1
VUSB: H5.2 P18.1(VBUS) U14.5
X_DIR_O: P3.2 U6.1(Q1)
X_LIMT: R6.2 U8.6(IO34)
X_LIMT_I: C3.2 P2.1 R5.1 R6.1
X_STEP_O: P3.3 U6.2(Q2)
Y1_EN_O: P5.4 R12.1 U3.4(Y) U6.6(Q6)
Y1_LI: R1.2 U8.8(IO32)
Y1_LIMT: C2.2 P4.1 R1.1 R4.2 R12.2 U1.1(A) U3.2(A)
Y2_EN_O: P7.4 R15.1 U5.4(Y) U6.5(Q5)
Y2_LI: R2.2 U8.9(IO33)
Y2_LIMT: C1.2 P4.2 R2.1 R3.2 R15.2 U1.2(B) U5.2(A)
Y_DIR_O: P5.2 P7.2 U6.3(Q3)
Y_LIMT: R8.2 U8.5(SENSOR_VN)
Y_LIMT_I: C6.2 R8.1 U1.4(Y)
Y_STEP_O: P5.3 P7.3 U6.4(Q4)
Z_DIR_O: P8.2 U7.1(Q1)
Z_LIMT: R13.2 U8.4(SENSOR_VP)
Z_LIMT_I: C12.2 P6.1 R11.1 R13.1
Z_STEP_O: P8.3 U6.7(Q7)
$9N72390: D2.2 L1.2 U2.2(OUTPUT)
$9N72392: R10.1 U2.4(ON/OFF)
$9N72730: D3.1 R7.1
$9N85928: C25.1 U12.4(V3)
$9N85949: U12.5(UD+) U14.6
$9N85958: U12.6(UD-) U14.4
$9N85962: C26.1 U12.7(XI) Y1.2(OSC2)
$9N85965: C29.1 U12.8(XO) Y1.1(OSC1)
$9N86544: R37.2 U12.2(TXD)
$9N86546: R38.2 R39.1 U12.3(RXD)
$9N86982: Q2.2(E) R45.1 U12.13(DTR#)
$9N86987: Q3.2(E) R41.1 U12.14(RTS#)
$9N89334: Q2.1(B) R41.2
$9N89338: Q3.1(B) R45.2
$9N98710: C17.2 K1.3 K1.4 P14.1 R20.2 R25.2
$9N100484: C18.2 P15.1 R21.2 R26.2
$9N100840: D7.1 R14.1
$9N100955: D5.1 R9.1
$9N125401: Q1.1(B) R33.1 R35.2
$9N133119: H1.3 H1.4
$9N166181: U6.9(Q7S) U7.14(DS)

Not connected (* = marked no-connect by the designer): D10 1(I/O1) 2(GND) 3(I/O2) 4(I/O2) 5(VBUS) 6(I/O1); U3 1(NC); U5 1(NC); U7 5(Q5) 6(Q6) 7(Q7) 9(Q7S); U8 17(SD2) 18(SD3) 19(CMD) 20(CLK) 21(SD0) 22(SD1) 32(NC); U9 1(NC); U10 1(NC); U11 1(NC); U12 9(CTS#) 10(DSR#) 11(RI#) 12(DCD#) 15(R232); U13 1(DAT2) 8(DAT1)

## Notes on the sheet
- 为了实现Y1和Y2谁先碰到限位谁先停下，没碰到的继续走直到碰到限位
- 24V转5V
- 用限位控制使能
- 用限位控制使能
- 单片机LDO电源3.3V
- I2SO(1)
- I2SO(2)
- I2SO(0)
- Y1_EN_PIN
- I2SO(5)
- I2SO(7)
- I2SO(9)
- I2SO(8)
- I2SO(10)
- I2SO(11)
- I2SO(12)
- I2SO(13)
- I2SO(14)
- I2SO(15)
- 正相
- SD_CS 可以不用
- PROBE
- 接激光
- IO15默认上拉
  IO5默认上拉
  IO12默认下拉
  IO2默认下拉
- I2S 任意脚都能用（除 34-39）
  不要把 I2S 时钟/数据线映射到 仅输入脚（34-39）；其余脚均可
- 反相
- UART2 可换任意脚（避 Strapping）
  若改到 Strapping 脚（0,2,4,5,12,15），需保证上电时满足启动电平，否则可能 无法启动或进入下载模式。
- 如果用74LVC1G17输出是否直接接上拉就行？
- USB转TTL
